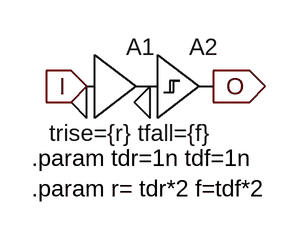
[diagram p0: schematic delay.asc]
delay.asc, the LTspice schematic file:
Version 4
SHEET 1 880 680
FLAG 144 176 0
FLAG 208 176 0
FLAG 272 160 O
IOPIN 272 160 Out
FLAG 144 160 I
IOPIN 144 160 In
SYMBOL Digital\\buf1 144 96 R0
WINDOW 3 -38 111 Left 2
SYMATTR Value trise={r} tfall={f}
SYMATTR InstName A1
SYMBOL Digital\\schmtbuf 208 96 R0
SYMATTR InstName A2
TEXT 88 232 Left 2 !.param tdr=1n tdf=1n\n.param r= tdr*2 f=tdf*2

The netlist it stands for:
* delay.asc
A1 I 0 0 0 0 0 P001 0 BUF trise={r} tfall={f}
A2 P001 0 0 0 0 0 O 0 SCHMITT
.param tdr=1n tdf=1n
.param r= tdr*2 f=tdf*2
.backanno
.end